# EAGLE design mikrofon-v1.2 (EAGLE 5.06)
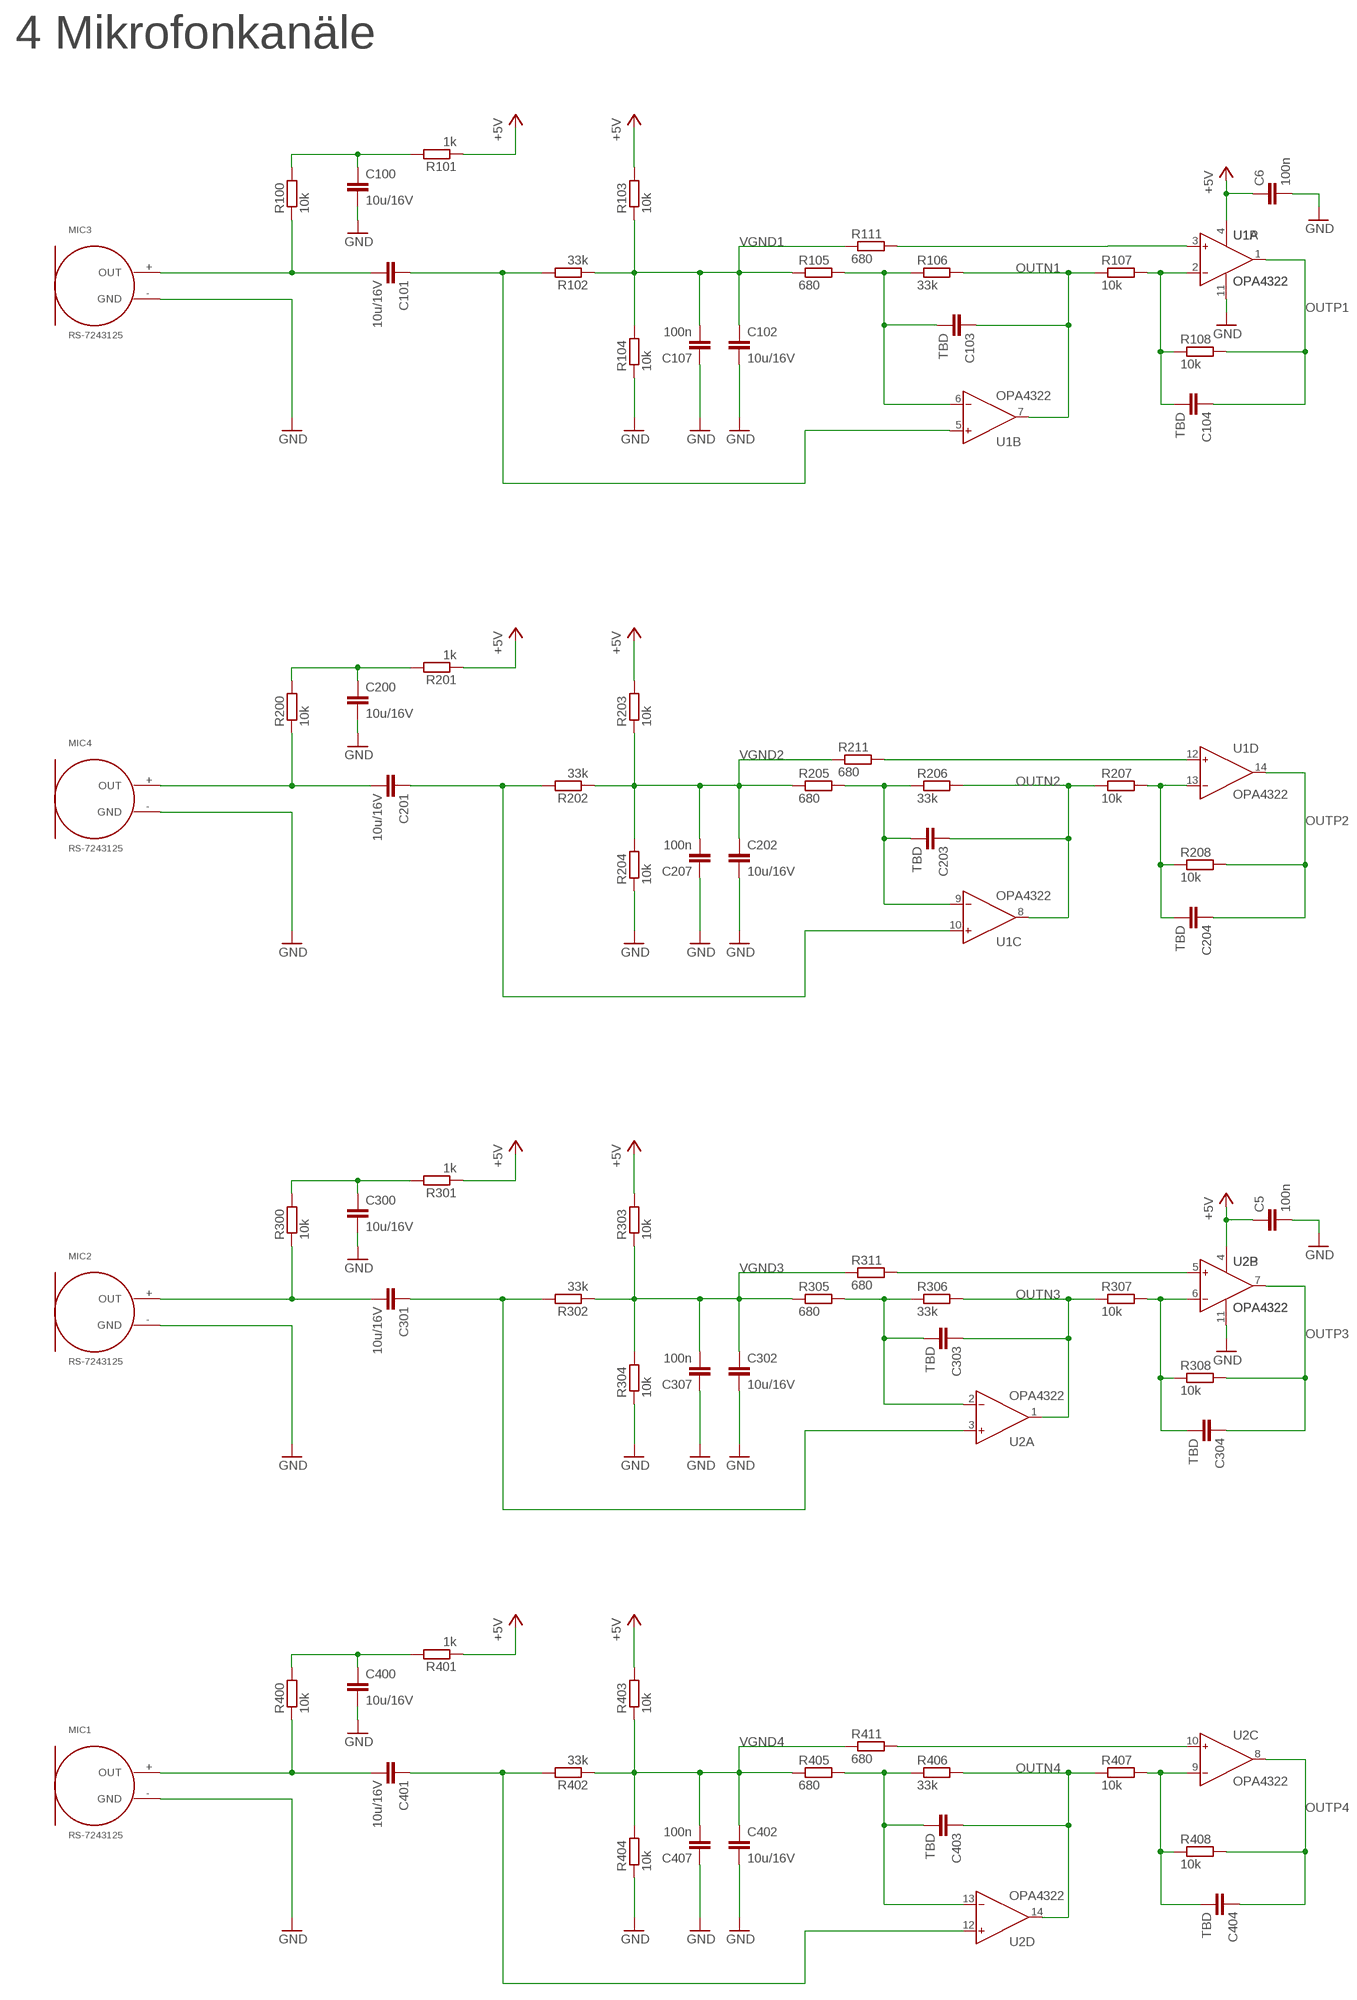
[diagram p0: schematic, sheet 1, part 1 of 2]
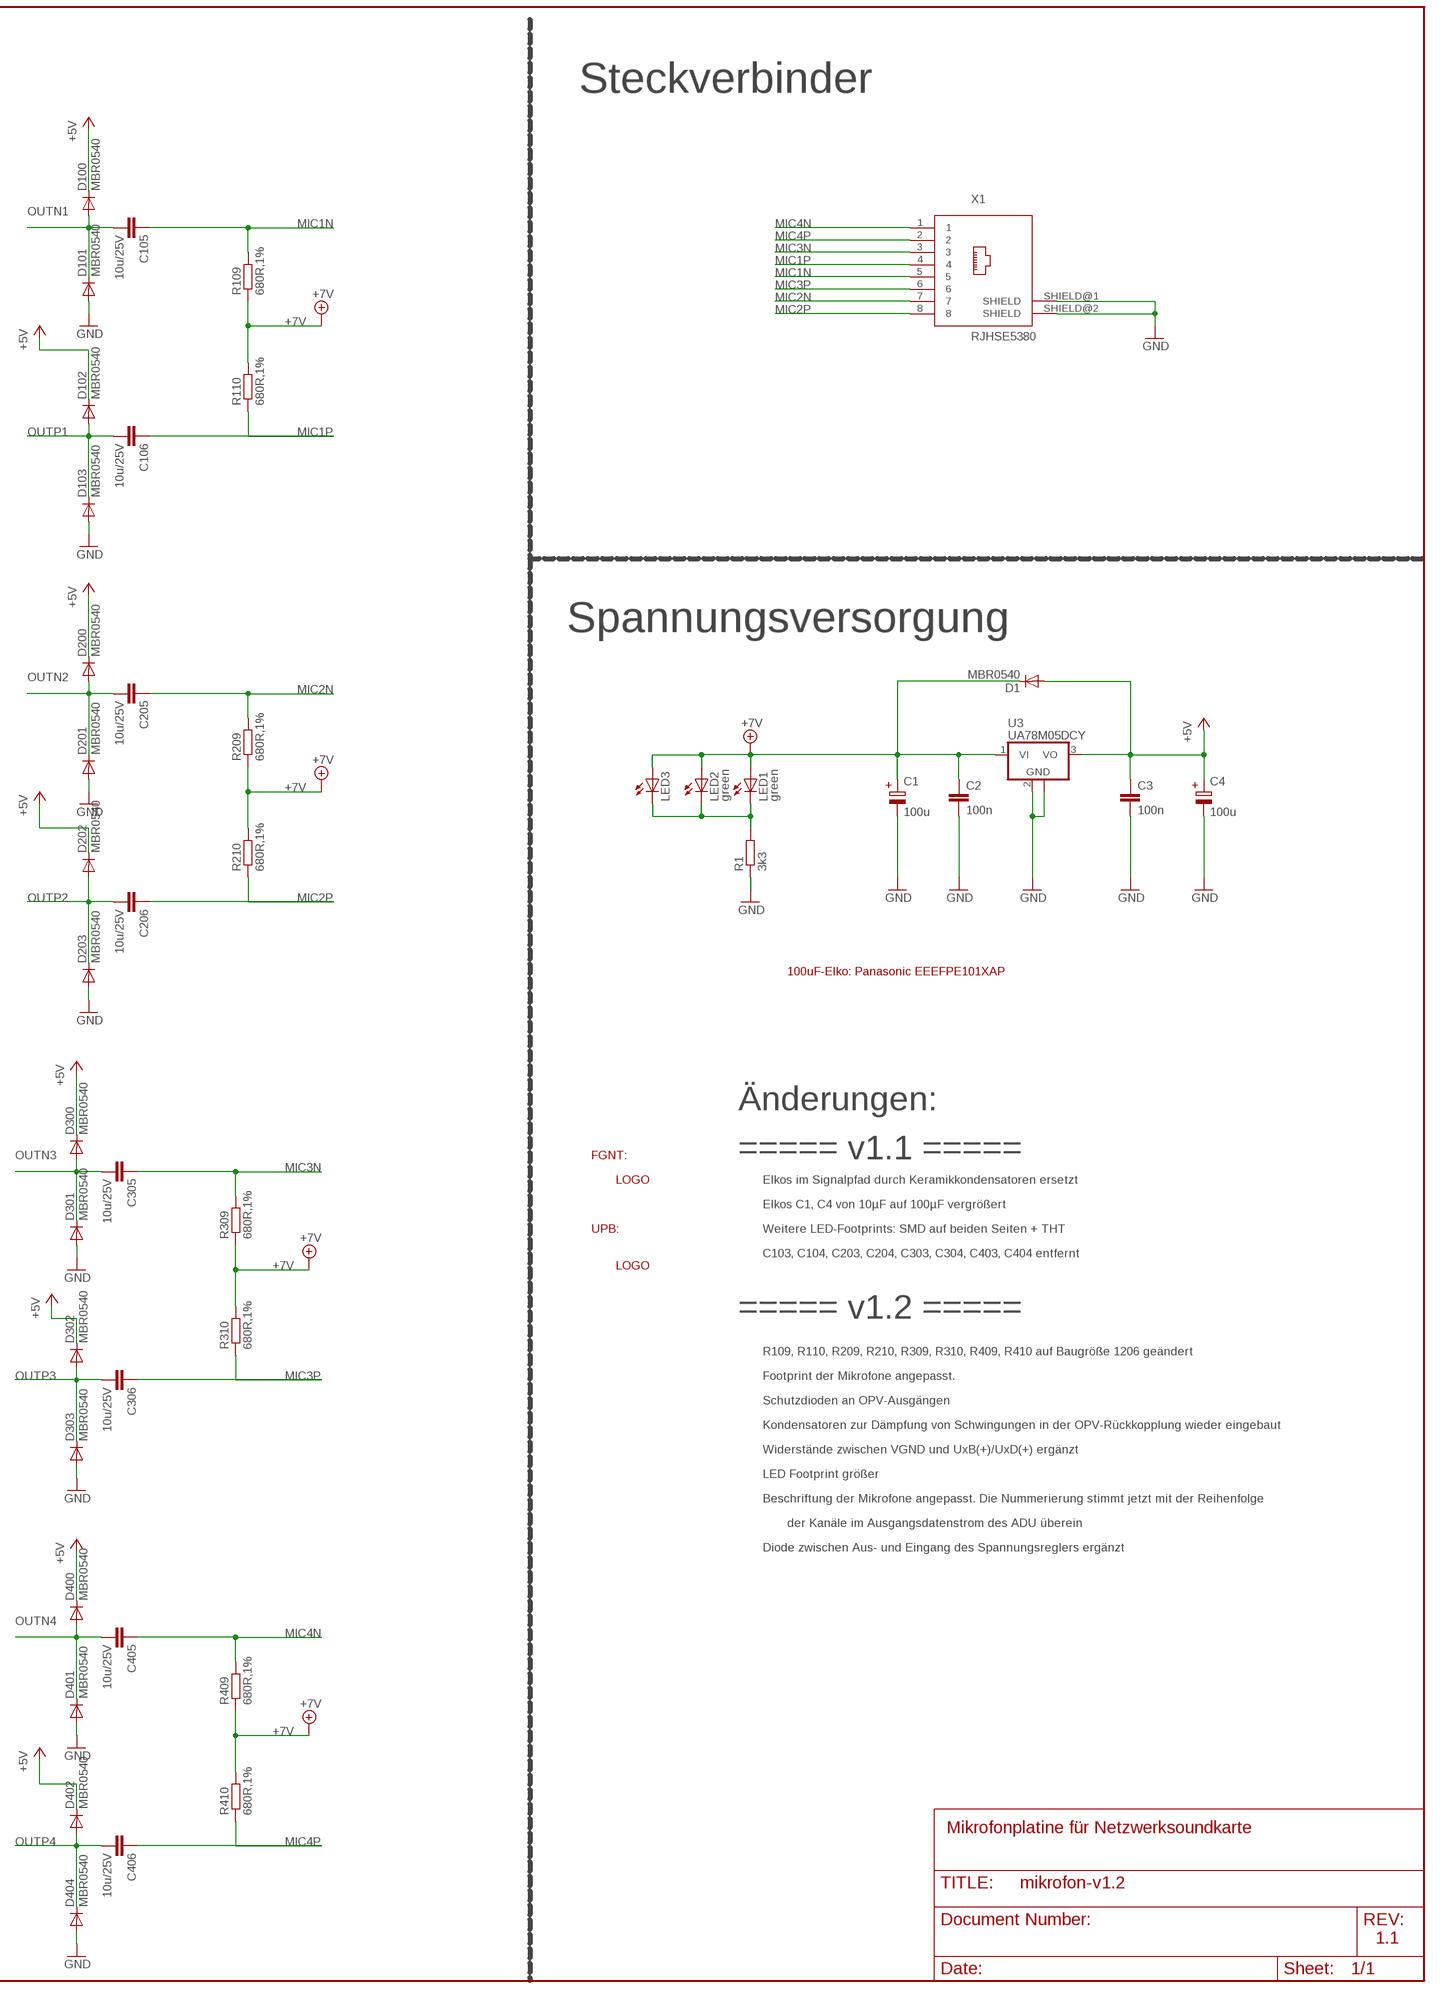
[diagram p1: schematic, sheet 1, part 2 of 2]

## Parts
C1  100u  PANASONIC_D8_LONGPAD  [PANASONIC_D8_LONGPAD]
C2  100n  C-EUC0603  [C0603]
C3  100n  C-EUC0603  [C0603]
C4  100u  PANASONIC_D8_LONGPAD  [PANASONIC_D8_LONGPAD]
C5  100n  C-EUC0603  [C0603]
C6  100n  C-EUC0603  [C0603]
C100  10u/16V  C-EUC1206  [C1206]
C101  10u/16V  C-EUC1206  [C1206]
C102  10u/16V  C-EUC1206  [C1206]
C103  TBD  C-EUC0603  [C0603]
C104  TBD  C-EUC0603  [C0603]
C105  10u/25V  C-EUC1206  [C1206]
C106  10u/25V  C-EUC1206  [C1206]
C107  100n  C-EUC0603  [C0603]
C200  10u/16V  C-EUC1206  [C1206]
C201  10u/16V  C-EUC1206  [C1206]
C202  10u/16V  C-EUC1206  [C1206]
C203  TBD  C-EUC0603  [C0603]
C204  TBD  C-EUC0603  [C0603]
C205  10u/25V  C-EUC1206  [C1206]
C206  10u/25V  C-EUC1206  [C1206]
C207  100n  C-EUC0603  [C0603]
C300  10u/16V  C-EUC1206  [C1206]
C301  10u/16V  C-EUC1206  [C1206]
C302  10u/16V  C-EUC1206  [C1206]
C303  TBD  C-EUC0603  [C0603]
C304  TBD  C-EUC0603  [C0603]
C305  10u/25V  C-EUC1206  [C1206]
C306  10u/25V  C-EUC1206  [C1206]
C307  100n  C-EUC0603  [C0603]
C400  10u/16V  C-EUC1206  [C1206]
C401  10u/16V  C-EUC1206  [C1206]
C402  10u/16V  C-EUC1206  [C1206]
C403  TBD  C-EUC0603  [C0603]
C404  TBD  C-EUC0603  [C0603]
C405  10u/25V  C-EUC1206  [C1206]
C406  10u/25V  C-EUC1206  [C1206]
C407  100n  C-EUC0603  [C0603]
D1  MBR0540  [SOD123]
D100  MBR0540  [SOD123]
D101  MBR0540  [SOD123]
D102  MBR0540  [SOD123]
D103  MBR0540  [SOD123]
D200  MBR0540  [SOD123]
D201  MBR0540  [SOD123]
D202  MBR0540  [SOD123]
D203  MBR0540  [SOD123]
D300  MBR0540  [SOD123]
D301  MBR0540  [SOD123]
D302  MBR0540  [SOD123]
D303  MBR0540  [SOD123]
D400  MBR0540  [SOD123]
D401  MBR0540  [SOD123]
D402  MBR0540  [SOD123]
D404  MBR0540  [SOD123]
LED1  green  LED0603_LONGPAD  [CHIPLED_0603_LONGPAD]
LED2  green  LED0603_LONGPAD  [CHIPLED_0603_LONGPAD]
LED3  LED3MM  [LED3MM]
MIC1  RS-7243125  [RS-7243125]
MIC2  RS-7243125  [RS-7243125]
MIC3  RS-7243125  [RS-7243125]
MIC4  RS-7243125  [RS-7243125]
R1  3k3  R-EU_R0603  [R0603]
R100  10k  R-EU_R0603  [R0603]
R101  1k  R-EU_R0603  [R0603]
R102  33k  R-EU_R0603  [R0603]
R103  10k  R-EU_R0603  [R0603]
R104  10k  R-EU_R0603  [R0603]
R105  680  R-EU_R0603  [R0603]
R106  33k  R-EU_R0603  [R0603]
R107  10k  R-EU_R0603  [R0603]
R108  10k  R-EU_R0603  [R0603]
R109  680R,1%  R-EU_R1206  [R1206]
R110  680R,1%  R-EU_R1206  [R1206]
R111  680  R-EU_R0603  [R0603]
R200  10k  R-EU_R0603  [R0603]
R201  1k  R-EU_R0603  [R0603]
R202  33k  R-EU_R0603  [R0603]
R203  10k  R-EU_R0603  [R0603]
R204  10k  R-EU_R0603  [R0603]
R205  680  R-EU_R0603  [R0603]
R206  33k  R-EU_R0603  [R0603]
R207  10k  R-EU_R0603  [R0603]
R208  10k  R-EU_R0603  [R0603]
R209  680R,1%  R-EU_R1206  [R1206]
R210  680R,1%  R-EU_R1206  [R1206]
R211  680  R-EU_R0603  [R0603]
R300  10k  R-EU_R0603  [R0603]
R301  1k  R-EU_R0603  [R0603]
R302  33k  R-EU_R0603  [R0603]
R303  10k  R-EU_R0603  [R0603]
R304  10k  R-EU_R0603  [R0603]
R305  680  R-EU_R0603  [R0603]
R306  33k  R-EU_R0603  [R0603]
R307  10k  R-EU_R0603  [R0603]
R308  10k  R-EU_R0603  [R0603]
R309  680R,1%  R-EU_R1206  [R1206]
R310  680R,1%  R-EU_R1206  [R1206]
R311  680  R-EU_R0603  [R0603]
R400  10k  R-EU_R0603  [R0603]
R401  1k  R-EU_R0603  [R0603]
R402  33k  R-EU_R0603  [R0603]
R403  10k  R-EU_R0603  [R0603]
R404  10k  R-EU_R0603  [R0603]
R405  680  R-EU_R0603  [R0603]
R406  33k  R-EU_R0603  [R0603]
R407  10k  R-EU_R0603  [R0603]
R408  10k  R-EU_R0603  [R0603]
R409  680R,1%  R-EU_R1206  [R1206]
R410  680R,1%  R-EU_R1206  [R1206]
R411  680  R-EU_R0603  [R0603]
U1  OPA4322  [TSSOP14]
U2  OPA4322  [TSSOP14]
U3  UA78M05DCY  [SOT223]
U$1  FGNT_NEG  [NT_T_NEG]
U$2  UPB_NEG  [UPB_T_NEG]
X1  RJHSE5380  [RJHSE5380]

## Nets
+5V: C3.1 C4.+ C5.1 C6.1 D1.A D100.C D102.C D200.C D202.C D300.C D302.C D400.C D402.C R101.1 R103.2 R201.1 R203.2 R301.1 R303.2 R401.1 R403.2 U1.4(P:V+) U2.4(P:V+) U3.3(VO)
+7V: C1.+ C2.1 D1.C LED1.A LED2.A LED3.A R109.1 R110.2 R209.1 R210.2 R309.1 R310.2 R409.1 R410.2 U3.1(VI)
GND: C1.- C2.2 C3.2 C4.- C5.2 C6.2 C100.2 C102.2 C107.1 C200.2 C202.2 C207.1 C300.2 C302.2 C307.1 C400.2 C402.2 C407.1 D101.A D103.A D201.A D203.A D301.A D303.A D401.A D404.A MIC1.-(GND) MIC2.-(GND) MIC3.-(GND) MIC4.-(GND) R1.1 R104.1 R204.1 R304.1 R404.1 U1.11(P:V-) U2.11(P:V-) U3.2(GND) U3.4(GND) X1.SHIELD@1(SHIELD) X1.SHIELD@2(SHIELD)
MIC1N: C105.1 R109.2 X1.5
MIC1P: C106.1 R110.1 X1.4
MIC2N: C205.1 R209.2 X1.7
MIC2P: C206.1 R210.1 X1.8
MIC3N: C305.1 R309.2 X1.3
MIC3P: C306.1 R310.1 X1.6
MIC4N: C405.1 R409.2 X1.1
MIC4P: C406.1 R410.1 X1.2
N$1: C103.2 R105.2 R106.1 U1.6(B:IN-)
N$2: C303.2 R305.2 R306.1 U2.2(A:IN-)
N$3: LED1.C LED2.C LED3.K(C) R1.2
N$4: R211.2 U1.12(D:IN+)
N$5: R111.2 U1.3(A:IN+)
N$6: C401.2 MIC1.+(OUT) R400.1
N$7: C101.2 MIC3.+(OUT) R100.1
N$8: C401.1 R402.2 U2.12(D:IN+)
N$9: C101.1 R102.2 U1.5(B:IN+)
N$10: C100.1 R100.2 R101.2
N$11: C400.1 R400.2 R401.2
N$12: C104.2 R107.2 R108.1 U1.2(A:IN-)
N$13: C404.2 R407.2 R408.1 U2.9(C:IN-)
N$14: C203.2 R205.2 R206.1 U1.9(C:IN-)
N$15: R411.2 U2.10(C:IN+)
N$16: R311.2 U2.5(B:IN+)
N$18: C301.2 MIC2.+(OUT) R300.1
N$19: C301.1 R302.2 U2.3(A:IN+)
N$20: C300.1 R300.2 R301.2
N$21: C304.2 R307.2 R308.1 U2.6(B:IN-)
N$22: C201.2 MIC4.+(OUT) R200.1
N$23: C201.1 R202.2 U1.10(C:IN+)
N$24: C200.1 R200.2 R201.2
N$25: C204.2 R207.2 R208.1 U1.13(D:IN-)
OUTN1: C103.1 C105.2 D100.A D101.C R106.2 R107.1 U1.7(B:OUT)
OUTN2: C203.1 C205.2 D200.A D201.C R206.2 R207.1 U1.8(C:OUT)
OUTN3: C303.1 C305.2 D300.A D301.C R306.2 R307.1 U2.1(A:OUT)
OUTN4: C403.1 C405.2 D400.A D401.C R406.2 R407.1 U2.14(D:OUT)
OUTP1: C104.1 C106.2 D102.A D103.C R108.2 U1.1(A:OUT)
OUTP2: C204.1 C206.2 D202.A D203.C R208.2 U1.14(D:OUT)
OUTP3: C304.1 C306.2 D302.A D303.C R308.2 U2.7(B:OUT)
OUTP4: C404.1 C406.2 D402.A D404.C R408.2 U2.8(C:OUT)
R405: C403.2 R405.2 R406.1 U2.13(D:IN-)
VGND1: C102.1 C107.2 R102.1 R103.1 R104.2 R105.1 R111.1
VGND2: C202.1 C207.2 R202.1 R203.1 R204.2 R205.1 R211.1
VGND3: C302.1 C307.2 R302.1 R303.1 R304.2 R305.1 R311.1
VGND4: C402.1 C407.2 R402.1 R403.1 R404.2 R405.1 R411.1

## Notes on the sheet
- 4 Mikrofonkanäle | Steckverbinder
- Spannungsversorgung
- 100uF-Elko: Panasonic EEEFPE101XAP
- Änderungen:
- FGNT: | ===== v1.1 =====
- Elkos im Signalpfad durch Keramikkondensatoren ersetzt
- Elkos C1, C4 von 10µF auf 100µF vergrößert
- UPB: | Weitere LED-Footprints: SMD auf beiden Seiten + THT
- C103, C104, C203, C204, C303, C304, C403, C404 entfernt
- ===== v1.2 =====
- R109, R110, R209, R210, R309, R310, R409, R410 auf Baugröße 1206 geändert
- Footprint der Mikrofone angepasst.
- Schutzdioden an OPV-Ausgängen
- Kondensatoren zur Dämpfung von Schwingungen in der OPV-Rückkopplung wieder eingebaut
- Widerstände zwischen VGND und UxB(+)/UxD(+) ergänzt
- LED Footprint größer
- Beschriftung der Mikrofone angepasst. Die Nummerierung stimmt jetzt mit der Reihenfolge
- der Kanäle im Ausgangsdatenstrom des ADU überein
- Diode zwischen Aus- und Eingang des Spannungsreglers ergänzt
- Mikrofonplatine für Netzwerksoundkarte
- 1.1

## Library data of the parts
C1 C4 = discrete:PANASONIC_D8_LONGPAD
C2 C3 C5 C6 C100-C107 C200-C207 C300-C307 C400-C407 = rcl:C-EU: CAPACITOR, European symbol
D1 D100-D103 D200-D203 D300-D303 D400-D402 D404 = diodes:MBR0540: SCHOTTKY BARRIER RECTIFIER 0.5A 40V
LED1 LED2 = diodes:LED0603_LONGPAD: 0603 Standard Chip LED Package hat verlängerte Pads
LED3 = led:LED: LED OSRAM: - CHIPLED LG R971, LG N971, LY N971, LG Q971, LY Q971, LO R971, LY R971 LH N974, LH R974 LS Q976, LO Q976, LY Q976 LO Q996 - Hyper CHIPLED LW Q18S LB Q993, LB Q99A, LB R99A - SideLED LS A670, LO A670, LY A670, LG A670, LP A670 LB A673, LV A673, LT A673, LW A673 LH A674 LY A675 LS A676, LA A676, LO A676, LY A676, LW A676 LS A679, LY A679, LG A679 - Hyper Micro SIDELED® LS Y876, LA Y876, LO Y876, LY Y876 LT Y87S - SmartLED LW L88C, LW L88S LB L89C, LB L89S, LG L890 LS L89K, LO L89K, LY L89K LS L896, LA L896, LO L896, LY L896 - TOPLED LS T670, LO T670, LY T670, LG T670, LP T670 LSG T670, LSP T670, LSY T670, LOP T670, LYG T670 LG T671, LOG T671, LSG T671 LB T673, LV T673, LT T673, LW T673 LH T674 LS T676, LA T676, LO T676, LY T676, LB T676, LH T676, LSB T676, LW T676 LB T67C, LV T67C, LT T67C, LS T67K, LO T67K, LY T67K, LW E67C LS E67B, LA E67B, LO E67B, LY E67B, LB E67C, LV E67C, LT E67C LW T67C LS T679, LY T679, LG T679 LS T770, LO T770, LY T770, LG T770, LP T770 LB T773, LV T773, LT T773, LW T773 LH T774 LS E675, LA E675, LY E675, LS T675 LS T776, LA T776, LO T776, LY T776, LB T776 LHGB T686 LT T68C, LB T68C - Hyper Mini TOPLED® LB M676 - Mini TOPLED Santana® LG M470 LS M47K, LO M47K, LY M47K Source: http://www.osram.convergy.de LUXEON: - LUMILED® LXK2-PW12-R00, LXK2-PW12-S00, LXK2-PW14-U00, LXK2-PW14-V00 LXK2-PM12-R00, LXK2-PM12-S00, LXK2-PM14-U00 LXK2-PE12-Q00, LXK2-PE12-R00, LXK2-PE12-S00, LXK2-PE14-T00, LXK2-PE14-U00 LXK2-PB12-K00, LXK2-PB12-L00, LXK2-PB12-M00, LXK2-PB14-N00, LXK2-PB14-P00, LXK2-PB14-Q00 LXK2-PR12-L00, LXK2-PR12-M00, LXK2-PR14-Q00, LXK2-PR14-R00 LXK2-PD12-Q00, LXK2-PD12-R00, LXK2-PD12-S00 LXK2-PH12-R00, LXK2-PH12-S00 LXK2-PL12-P00, LXK2-PL12-Q00, LXK2-PL12-R00 Source: www.luxeon.com KINGBRIGHT: KA-3528ASYC Source: www.kingbright.com
MIC1-MIC4 = analog:RS-7243125: Electret Condenser Microphone SNR > 60dB Sensitivity -40dB Standard operating voltage: 2V Max operating voltage: 10V Max current consumption: 0.5mA
R1 R100-R111 R200-R211 R300-R311 R400-R411 = rcl:R-EU_: RESISTOR, European symbol
U1 U2 = analog:OPA4322: 20-MHz, Low-Noise, 1.8-V, RRI/O, CMOS Operational Amplifier
U3 = linear:UA78M*: POSITIVE-VOLTAGE REGULATORS Source: http://focus.ti.com/lit/ds/symlink/ua78m33.pdf
U$1 = logo:FGNT_NEG
U$2 = logo:UPB_NEG: UPB-Logo (Negativschrift in Kupfer)
X1 = connector:RJHSE5380

## Board
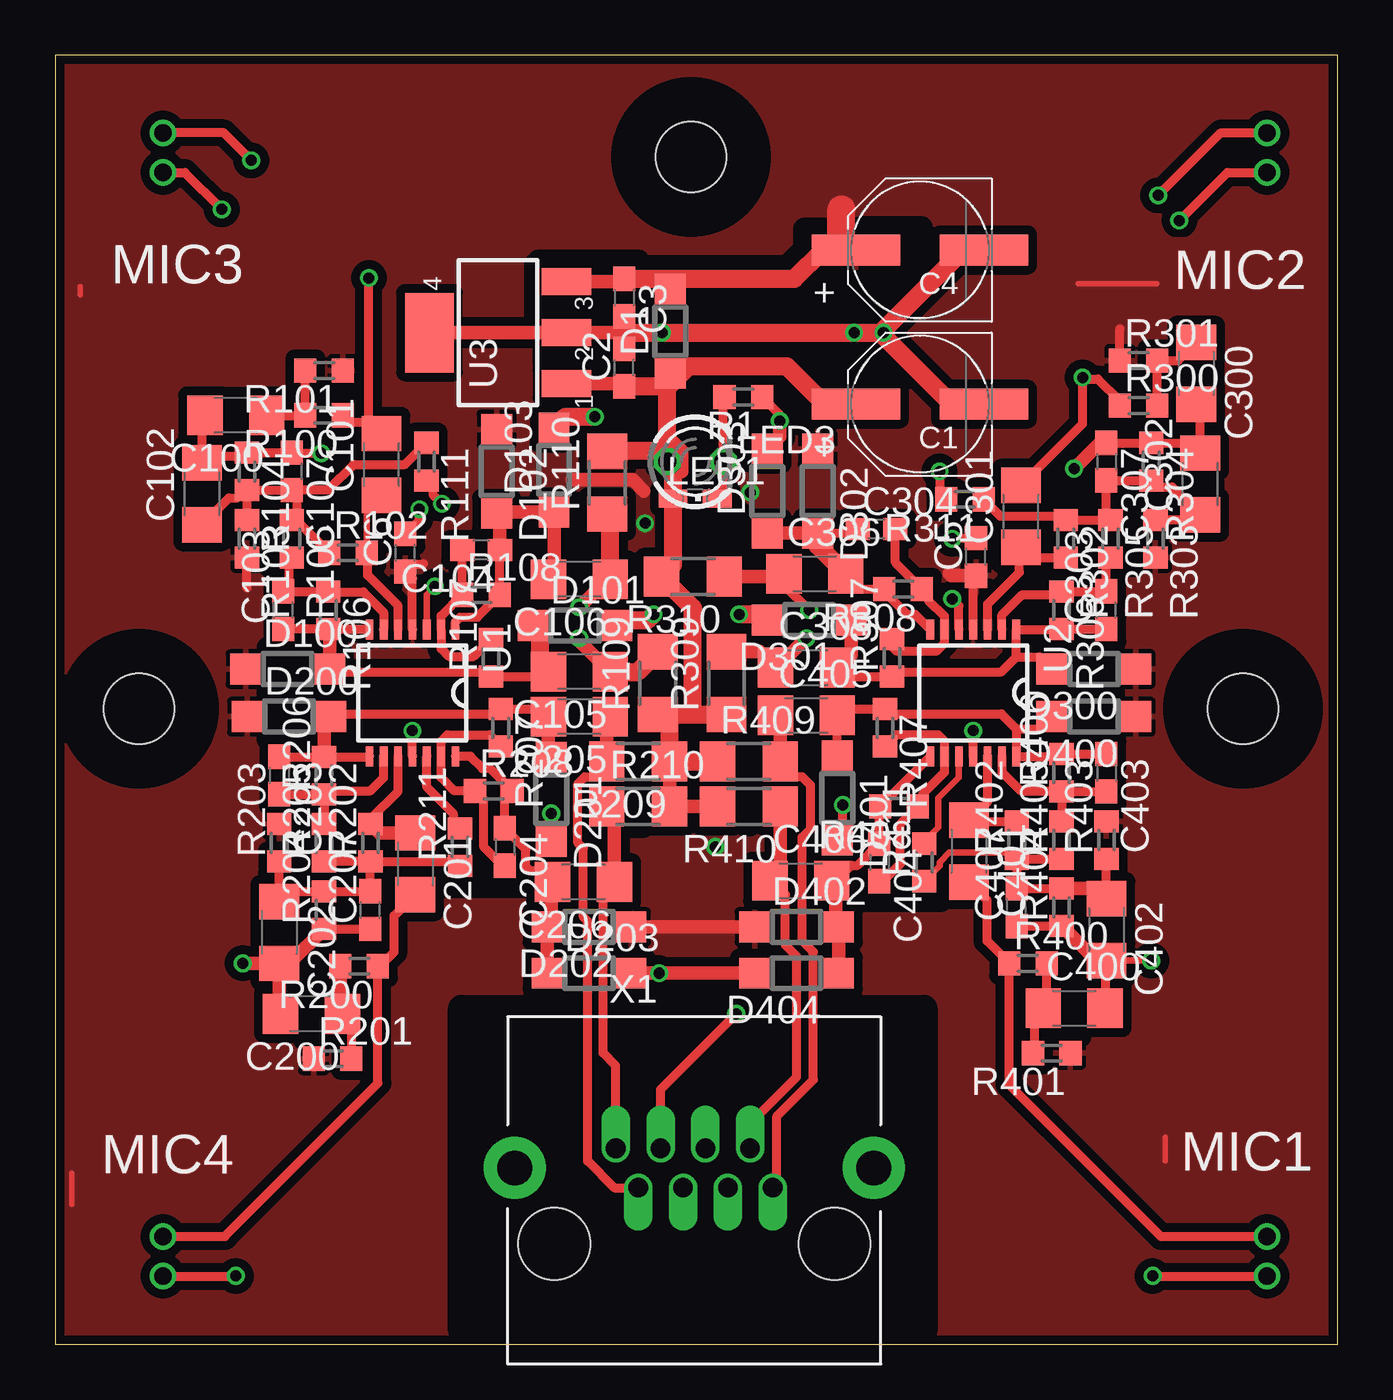
[diagram p2: board, top side]
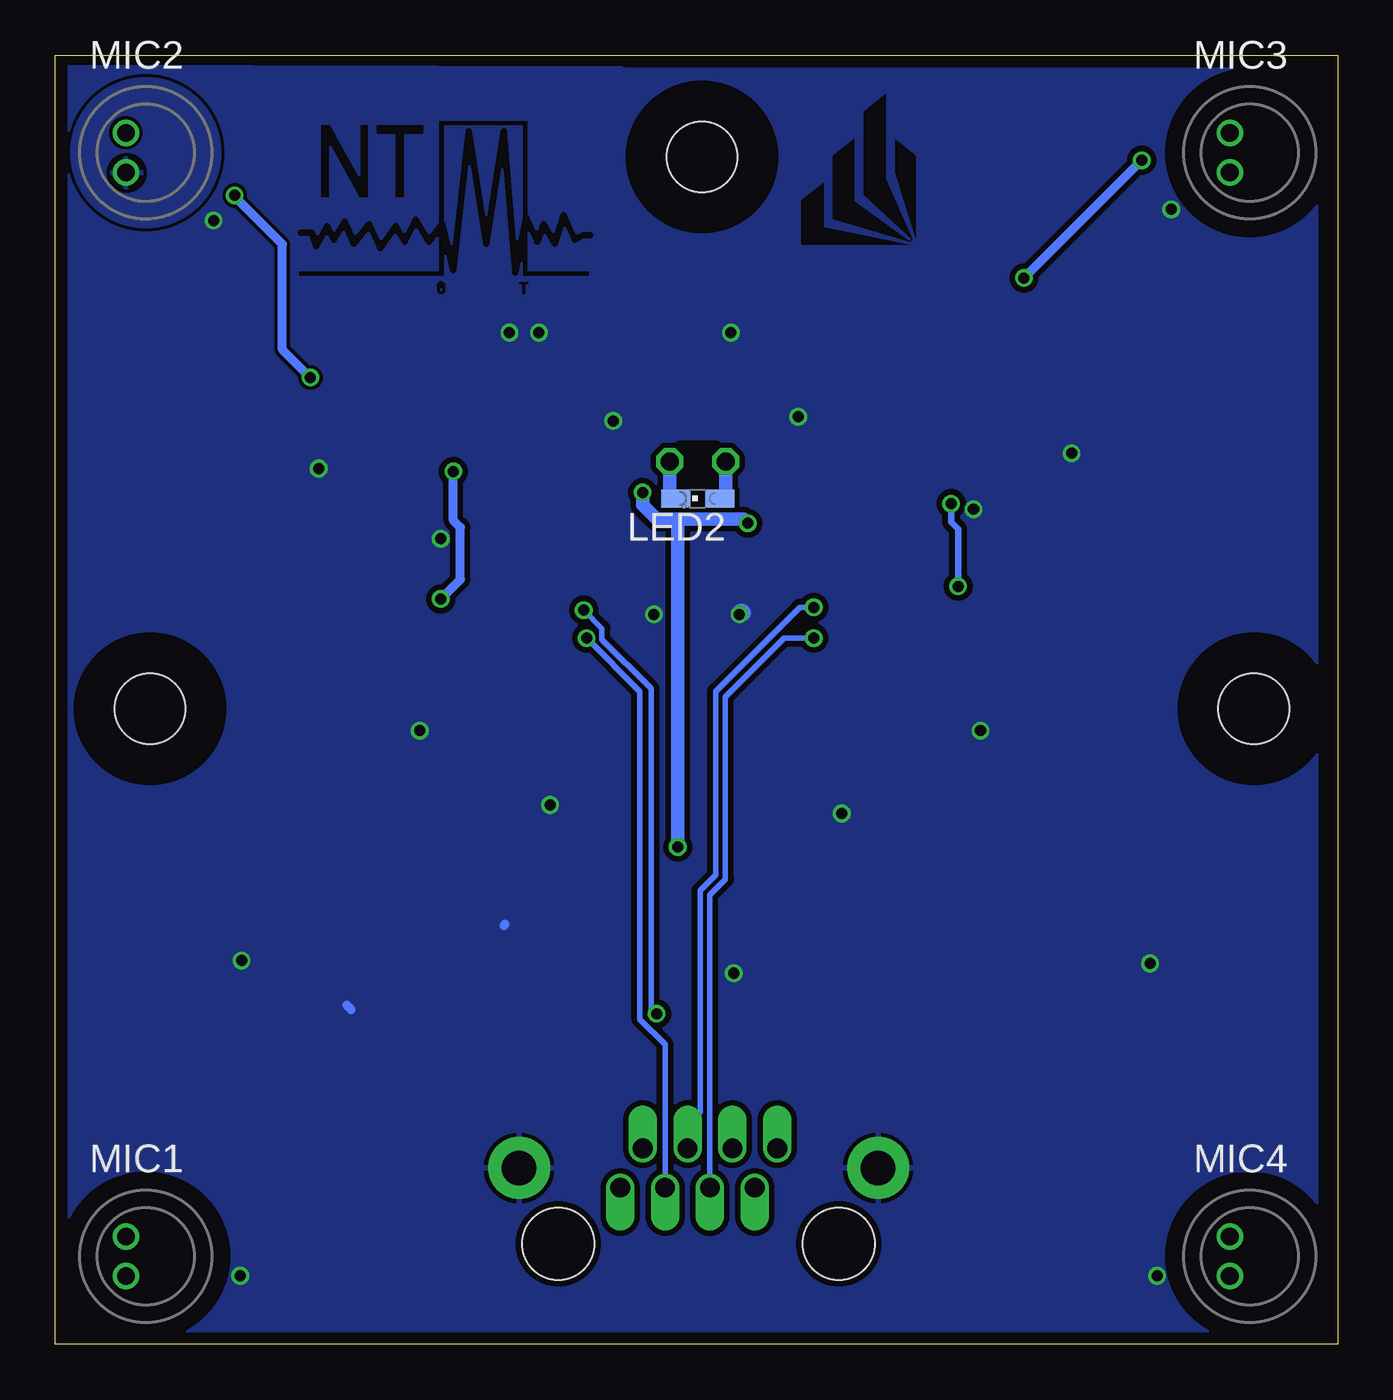
[diagram p3: board, bottom side, seen from below]

Size 58.09 x 58.41 mm. Coordinates in mm from the lower left corner, seen from the top.
Outline: 58.09,58.41 0,58.41 0,0 58.09,0 58.09,58.41
Copper layers (1*16): Top 0.035mm / dielectric 1.5mm / Bottom 0.035mm
Design rules "PCB-POOL Standard *": minimum track width 0.15mm, minimum drill 0.3mm, track to track 0.15mm, track to pad 0.15mm, pad to pad 0.15mm, via to via 0.15mm, smd to smd 0.15mm, copper to edge 0.3mm, drill to drill 0.2mm, minimum pad ring 0.2mm, minimum via ring 0.15mm, stop-mask expansion 0.075mm, vias tented up to drill 0mil, thermal gap 0.2mm
Holes 3.2 mm at 3.8,28.8 28.8,53.8 53.8,28.8
tRestrict: area 0.8,25.8 to 6.8,31.8; area 25.8,50.8 to 31.8,56.8; area 50.8,25.8 to 56.8,31.8; 52 lines
bRestrict: area 4,2.2 to 5.7,3.9; area 54.1,2.2 to 55.7,3.9; area 54,52.2 to 55.7,53.9; area 4,52.2 to 5.7,53.9; area 0.8,25.8 to 6.8,31.8; area 25.8,50.8 to 31.8,56.8; area 50.8,25.8 to 56.8,31.8; 1 lines

### Footprints (pad centres in the part's own frame; a part is rotated, then mirrored left to right if it is on the bottom)
PANASONIC_D8_LONGPAD = smd 4 x 1.4: + 2.9,0; - -2.9,0
C0603 = smd 1.1 x 1: 1 -0.85,0; 2 0.85,0
C1206 = smd 1.6 x 1.8: 1 -1.4,0; 2 1.4,0
SOD123 = smd 1.4 x 1.4: A 1.9,0; C -1.9,0
CHIPLED_0603_LONGPAD = smd 0.8 x 1.3: A 0,-1; C 0,1
LED3MM = drill 0.813 octagon: A -1.27,0; K 1.27,0
RS-7243125 = drill 0.8 round: + -0.9,0.9; - -0.9,-0.9
R0603 = smd 1 x 1.1: 1 -0.85,0; 2 0.85,0
R1206 = smd 1.6 x 1.803: 1 -1.422,0; 2 1.422,0
TSSOP14 = smd 0.9 x 0.35: 1 -2.875,1.95; 2 -2.875,1.3; 3 -2.875,0.65; 4 -2.875,0; 5 -2.875,-0.65; 6 -2.875,-1.3; 7 -2.875,-1.95; 8 2.875,-1.95; 9 2.875,-1.3; 10 2.875,-0.65; 11 2.875,0; 12 2.875,0.65; 13 2.875,1.3; 14 2.875,1.95
SOT223 = smd 1.219 x 2.235: 1 -2.311,-3.099; 2 0,-3.099; 3 2.311,-3.099 | smd 3.6 x 2.2: 4 0,3.099
RJHSE5380 = drill 0.89 pad 1.25 offset: 1 7.11,-1.78; 2 6.09,0; 3 5.08,-1.78; 4 4.06,0; 5 3.05,-1.78; 6 2.03,0; 7 1.02,-1.78; 8 0,0 | drill 1.57 pad 2.8 round: SHIELD@1 -4.57,-0.89; SHIELD@2 11.69,-0.89 | hole 3.25: -2.79,-4.32; 9.91,-4.32

### Placement (x,y rotation side)
C1  39.17,42.6 180 top
C2  25.77,44.25 90 top
C3  25.77,47.42 270 top
C4  39.17,49.58 180 top
C5  41.71,35.68 90 top
C6  15.86,35.87 90 top
C100  8.18,42.09 180 top
C101  14.78,39.87 90 top
C102  6.66,38.53 90 top
C103  10.34,33.26 90 top
C104  19.29,35.99 180 top
C105  23.74,30.47 180 top
C106  23.74,34.66 180 top
C107  10.72,39.55 270 top
C200  11.61,14.98 180 top
C201  16.31,21.77 270 top
C202  10.15,18.66 270 top
C203  10.15,25.77 270 top
C204  20.37,22.53 270 top
C205  23.74,28.44 180 top
C206  23.93,20.94 180 top
C207  14.28,19.67 90 top
C300  51.68,44 270 top
C301  43.74,37.52 90 top
C302  51.87,38.98 90 top
C303  47.61,33.26 90 top
C304  37.2,36.95 0 top
C305  34.02,30.66 0 top
C306  34.4,34.91 0 top
C307  47.61,40 270 top
C400  46.15,15.23 0 top
C401  41.39,22.34 270 top
C402  47.61,18.79 270 top
C403  47.61,25.9 270 top
C404  37.33,21.83 270 top
C405  34.02,28.5 0 top
C406  33.77,21.01 0 top
C407  43.55,19.8 90 top
D1  27.86,45.9 90 top
D100  10.53,30.6 0 top
D101  23.55,32.57 0 top
D102  19.99,39.55 270 top
D103  22.59,39.61 90 top
D200  10.59,28.44 0 top
D201  22.47,24.69 270 top
D202  24.18,18.91 180 top
D203  24.18,16.82 0 top
D300  47.04,30.6 180 top
D301  34.15,32.82 180 top
D302  34.53,38.66 270 top
D303  32.25,38.66 90 top
D400  47.04,28.44 180 top
D401  35.42,24.75 270 top
D402  33.58,18.91 0 top
D404  33.58,16.82 180 top
LED1  28.99,38.32 270 top
LED2  28.99,38.32 90 bottom
LED3  28.99,39.99 0 top
MIC1  53.99,3.99 0 bottom
MIC2  53.99,53.99 0 bottom
MIC3  3.99,53.99 0 bottom
MIC4  3.99,3.99 0 bottom
R1  31.17,42.92 180 top
R100  12.18,42.09 180 top
R101  12.18,44.12 180 top
R102  13.26,35.87 0 top
R103  8.69,36.5 270 top
R104  8.69,39.55 270 top
R105  10.72,36.5 270 top
R106  12.37,33.26 270 top
R107  19.74,31.1 90 top
R108  19.29,33.96 0 top
R109  27.29,29.96 90 top
R110  25.01,39.04 90 top
R111  16.82,40 270 top
R200  13.77,17.13 180 top
R201  12.56,12.94 0 top
R202  14.28,22.72 90 top
R203  10.15,22.72 90 top
R204  12.18,19.67 90 top
R205  12.18,22.72 90 top
R206  12.18,25.77 90 top
R207  20.18,27.93 270 top
R208  19.86,25.07 0 top
R209  26.4,26.41 180 top
R210  26.4,24.37 0 top
R211  18.34,22.53 90 top
R300  49.07,42.54 0 top
R301  49.07,44.57 0 top
R302  45.77,36.5 270 top
R303  49.83,36.5 270 top
R304  49.64,40 270 top
R305  47.8,36.5 270 top
R306  45.58,33.26 270 top
R307  37.9,31.1 90 top
R308  38.4,34.22 180 top
R309  30.4,29.96 90 top
R310  28.88,34.79 180 top
R311  41.2,38.28 180 top
R400  44.06,17.26 0 top
R401  45.14,13.2 180 top
R402  43.55,22.85 90 top
R403  47.61,22.85 90 top
R404  45.58,19.8 90 top
R405  45.58,22.85 90 top
R406  45.58,25.9 90 top
R407  37.58,27.93 270 top
R408  38.21,24.37 180 top
R409  31.42,26.41 0 top
R410  31.42,24.37 180 top
R411  39.36,21.83 90 top
U1  16.18,29.52 270 top
U2  41.58,29.52 270 top
U3  20.05,45.84 90 top
U$1  40.56,51.36 0 bottom
U$2  18.72,51.23 0 bottom
X1  25.39,8.88 0 top

### Tracks (layer width: path | path; a pad name or v marks a point on that pad's centre or on a via)
+5V  (via drill 0.5)
  Top 0.254: 48.22,46 48.25,46.03 | 46.34,48.06 49.9,48.06 | 0.75,6.34 0.75,7.74 | 50.28,8.31 50.28,9.39 | 1.13,47.55 1.13,47.93
  Top 0.406: 8.69,34.28 R103.2 | R301.1 48.22,46 | 16.05,35.36 16.69,35.36 | U2.4 41.58,34.76 | D1.A 27.86,48.15 27.74,48.27 | U1.4 16.18,34.7 C6.1
  Top 0.61: U3.3 25.77,48.15 C3.1 | C5.1 40.59,34.83 40.5,34.91 | D202.C D402.C | 23.42,39.17 26.15,39.17 26.66,38.66
  Top 0.813: C4.+ 35.61,49.58 34.79,49.58 33.48,48.27 27.74,48.27 C3.1
  Top 1.27: 35.61,49.58 35.61,51.43
  Bottom 0.61: v29.9,22.53 29.9,37.39 | 29.9,37.39 30.85,37.39 31.48,38.03 v31.48,38.6 | 29.9,37.39 26.91,37.39 v26.72,37.2
  pour Top (isolate 0.406): 57.99,57.99 -0.01,57.99 -0.01,-0.01 57.99,-0.01
  pour Top: 50.41,10.53 56.88,10.53 56.88,7.36 50.41,7.36
  pour Top: 48.69,50.09 56.88,50.09 56.88,47.17 48.69,47.17
  pour Top: 0.56,10.09 8.75,10.09 8.75,7.17 0.56,7.17
  pour Top: 49.07,10.34 57.26,10.34 57.26,7.42 49.07,7.42
  pour Top: 0.94,50.28 9.13,50.28 9.13,47.36 0.94,47.36
+7V
  Top 0.406: C2.1 25.55,43.61 | D1.C 27.86,43.53
  Top 0.61: U3.1 25.77,43.53 C2.1 | 27.83,25.9 R210.2 R410.2 | 28.37,39.55 28.37,40.5 27.99,40.88 27.72,40.88
  Top 0.813: 25.67,43.3 C2.1 27.67,43.4 | 27.72,40.5 27.72,40.88 27.72,43.34 27.78,43.4 | LED3.A 27.72,40.5 | C1.+ 34.85,42.6 33.13,44.31 28.69,44.31 27.78,43.4 | R310.2 27.29,34.62 | LED3.A 27.98,39.72 | R109.1 R309.1 | R109.1 27.83,28.54 R209.1 | 27.83,25.9 R209.1 | R109.1 28.88,28.54 28.88,33.37 R310.2 | LED3.A 27.99,39.72 LED2.A 27.99,35.32 R310.2 | 27.67,43.4 | 27.78,43.4 27.67,43.4 | 27.78,43.4 27.78,43.91 D1.C | R110.2 27.72,40.46 27.72,40.5 | R209.1 R409.1
  Bottom 0.61: LED2.A 27.72,38.32 LED3.A
GND  (via drill 0.5)
  Top 0.254: 8.54,40.25 R104.1 | 7.1,40.25 6.79,39.93 C102.2
  Top 0.305: 6.66,41.97 C100.2 | C402.2 47.15,16.92 | C402.2 v49.64,17.39 | C402.2 47.55,17.32 | 47.57,40.88 C307.1 | C6.2 15.86,36.5 15.86,36.57 | 46.98,17.77 47.23,17.77 C402.2 | C107.1 10.74,40.38
  Top 0.406: 25.77,46.47 C3.2 | U2.11 v41.58,27.8 | R104.1 C107.1 | R204.1 C207.1 | C407.1 R404.1 | C307.1 R304.1 51.07,40.84 51.17,40.95 51.17,40.84 51.63,40.38 C302.2 51.87,42.41 C300.2 | C102.2 6.66,41.97 | 47.55,17.32 C400.2 | U1.11 v16.18,27.8 | 7.1,40.25 8.54,40.25 | 10.74,40.38 v12.05,40.38 | MIC4.- v8.17,3.09 v8.18,3.1 | MIC3.- 5.88,53.09 v7.54,51.43 | v50.91,50.92 53.09,53.09 MIC2.- | v49.71,3.1 49.72,3.09 MIC1.- | 15.86,36.5 15.86,36.69 16.5,37.33 v16.5,37.84 | v35.67,24.44 35.67,23.11 D401.A | v32.82,41.84 32.82,42.12 R1.1 | D303.A | v40.63,36.5 41.68,36.5 C5.2 | 10.68,17.32 10.21,17.32 C202.2
  Top 0.61: U3.4 U3.2 25.77,45.84 | 25.77,46.47 25.77,46.79 | 47.57,40.88 47.36,40.88 v46.15,39.68 | D201.A v22.47,24.06 | 46.98,17.77 46.76,17.77 R404.1 | D203.A v27.36,16.82 D404.A | 10.68,17.32 R204.1 | C200.2 10.15,15.04 C202.2 v8.5,17.26 | v32.82,41.84 32.82,41.13 D303.A
  Top 0.813: C4.- 41.14,49.58 37.39,45.84 37.38,45.84 | 25.77,45.84 v27.48,45.84 v36.18,45.84 37.38,45.84 | 37.38,45.84 v37.52,45.84 | C1.- 40.62,42.6 37.38,45.84 | v24.44,42.03 23.11,42.03 D103.A | v27.1,33.07 26.85,32.82 25.7,32.82 D101.A | v30.98,33.07 32,33.07 D301.A
  Top 1.016: C2.2 25.77,45.84 25.77,46.47
  Bottom 0.305: v12.05,40.38 11.99,40.38
  Bottom 0.406: 44.69,15.17 44.88,15.36 | 37.71,19.04 37.77,18.98
  Bottom 0.813: v27.1,33.07 27.04,33.14 26.98,33.14
  pour Bottom (isolate 0.254): 57.45,57.77 48.18,57.77 32.44,57.77 0.94,57.77 0.94,0.62 57.45,0.62
  pour Bottom: 32.44,57.84 57.45,57.9 57.45,43.11 32.44,43.04
  pour Bottom: 24.82,57.27 13.96,57.27 13.96,49.65 24.82,49.65
  pour Bottom: 49.26,10.98 55.68,10.98 55.68,8.05 49.26,8.05
  pour Bottom: 3.97,22.28 25.39,22.28 25.39,13.77 3.97,13.77
  pour Bottom: 50.41,50.03 56.82,50.03 56.82,47.11 50.41,47.11
  pour Bottom: 1.64,49.84 8.05,49.84 8.05,46.92 1.64,46.92
  pour Bottom: 2.4,10.79 8.81,10.79 8.81,7.86 2.4,7.86
MIC1N  (via drill 0.5)
  Top 0.61: v23.74,31.99 23.74,31.87 C105.1
  Top 0.813: R109.2 26.38,30.47 C105.1
  Bottom 0.254: X1.5 28.44,20.37 27.74,21.07 27.74,29.33 25.07,31.99 v23.74,31.99
MIC1P  (via drill 0.5)
  Top 0.61: v23.74,33.39 24.69,34.34 24.82,34.34 C106.1
  Top 0.813: R110.1 25.14,37.62 C106.1
  Bottom 0.254: X1.4 29.45,9.96 28.88,10.53 28.88,20.56 28.18,21.26 28.18,29.58 24.37,33.39 v23.74,33.39
MIC2N
  Top 0.406: X1.7 25.33,7.1 24.12,8.31 24.12,19.17 23.93,19.36 23.93,22.47 23.67,22.72 23.67,25.39 23.99,25.71 24.31,25.71 24.31,25.73 R209.2
  Top 0.61: R209.2 24.98,28.28 C205.1
MIC2P
  Top 0.406: X1.8 25.39,12.63 24.82,13.2 24.82,20.43 C206.1
  Top 0.61: R210.1 25.33,24.03 C206.1
MIC3N  (via drill 0.5)
  Top 0.61: R309.2 31.9,31.38 C305.1 32.66,30.63 | 32.63,30.6 32.66,30.63 | v34.02,31.99 32.66,30.63
  Bottom 0.254: X1.3 30.47,13.58 31.61,14.72 31.61,29.58 v34.02,31.99
MIC3P  (via drill 0.5)
  Top 0.406: X1.6 27.42,11.54 v30.85,14.98 | v34.15,33.26 33,34.41 C306.1
  Top 0.61: R310.1 32.88,34.79 C306.1
  Bottom 0.254: v30.85,14.98 31.1,15.23 31.1,29.71 33.32,31.93 33.32,32.44 v34.15,33.26
MIC4N
  Top 0.406: X1.1 32.69,7.29 32.69,10.34 34.34,11.99 34.34,17.77 33.83,18.28 33.83,22.98 34.21,23.36 34.21,25.33 33.83,25.71 33.54,25.71 R409.2
  Top 0.61: R409.2 32.84,28.28 C405.1
MIC4P
  Top 0.254: X1.2
  Top 0.406: X1.2 31.48,10.02 33.58,12.12 33.58,17.58 33.07,18.09 33.07,20.37 33.01,20.37 C406.1 | R410.1 32.75,24.28
  Top 0.61: R410.1 32.84,21.48 C406.1
N$1
  Top 0.305: R106.1 12.39,34.09 | 10.83,35.65 R105.2
  Top 0.406: U1.6 14.88,33.17 13.96,34.09 12.39,34.09 | R106.1 C103.2 10.59,34.37 10.59,35.42 10.82,35.65 10.83,35.65
N$2
  Top 0.305: 45.43,33.96 R306.1 45.86,34.11 45.86,34.18
  Top 0.406: U2.2 42.88,33.04 43.8,33.96 45.43,33.96 | R306.1 C303.2 47.61,35.46 R305.2
N$3
  Top 0.406: LED1.C 30.26,38.59 LED3.K 30.26,42.86 R1.2
  Bottom 0.61: LED1.C 30.26,38.32 LED3.K
N$4
  Top 0.406: U1.12 16.83,25.25 18.02,24.06 18.02,23.7 R211.2
N$5  (via drill 0.5)
  Top 0.305: U1.3 16.83,33.98 v17.2,34.34
  Top 0.406: v17.51,38.09 17.13,38.47 17.13,38.83 R111.2
  Bottom 0.305: v17.2,34.34 17.2,36.95 17.51,37.27 v17.51,38.09
N$6
  Top 0.406: MIC1.+ 50.08,4.89 43.21,11.76 R400.1 43.21,17.29 42.21,18.28 42.21,20.12 C401.2
N$7  (via drill 0.5)
  Top 0.254: 13.35,41.77 R100.1 | 14.4,41.77 14.78,41.39 C101.2 14.21,41.84
  Top 0.305: C101.2 14.78,41.07 14.4,41.07 14.4,41.54
  Top 0.406: 14.4,41.77 13.35,41.77 | 14.21,41.84 v14.21,48.31 | MIC3.+ 7.63,54.89 v8.88,53.65
  Bottom 0.406: v14.21,48.31 v8.88,53.65
N$8
  Top 0.305: C401.1 41.89,23.74
  Top 0.406: U2.12 42.23,24.58 C401.1 | R402.2 41.94,23.7 41.89,23.74
N$9
  Top 0.305: 14.15,35.83 R102.2 14.11,37.79 C101.1
  Top 0.406: U1.5 15.53,33.47 14.15,34.85 14.15,35.83
N$10
  Top 0.406: R101.2 R100.2 C100.1
N$11
  Top 0.254: R401.2 44.37,13.2 | 44.37,14.91 44.75,14.91 C400.1
  Top 0.406: 44.37,13.2 44.37,14.91 | R400.2 44.91,15.38 C400.1
N$12
  Top 0.406: C104.2 R108.1 17.48,33 U1.2 17.48,31.52 17.83,31.17 18.95,31.17 R107.2
N$13
  Top 0.305: 37.56,27.08 R407.2
  Top 0.406: 37.56,27.08 38.09,27.61 39.99,27.61 40.28,27.32 U2.9 40.28,25.93 39.29,24.95 39.29,24.6 R408.1 38.28,23.59 38.28,21.77 37.49,20.98 C404.2
N$14
  Top 0.406: U1.9 14.88,25.68 14.27,25.07 12.33,25.07 R206.1 | R206.1 R205.2 | C203.2 R206.1
N$15
  Top 0.305: R411.2 39.36,22.79 39.99,23.42 39.99,24.75 40.93,25.69 U2.10
N$16  (via drill 0.5)
  Top 0.406: U2.5 40.93,33.47 v40.63,33.77 | R311.2 40.35,38.3 40.06,38.6 v40.06,39.55
  Bottom 0.406: v40.63,33.77 39.74,34.66 39.74,37.01 40.06,37.33 v40.06,39.55
N$18  (via drill 0.5)
  Top 0.406: MIC2.+ 52.79,54.89 v49.96,52.06 | R300.1 48.22,42.75 47.23,43.74 46.6,43.74 v46.53,43.8 46.53,41.71 C301.2
  Bottom 0.254: 49.96,52 v49.96,52.06
  Bottom 0.406: v46.53,43.8 47.8,45.08 47.8,49.84 49.96,52
N$19
  Top 0.406: U2.3 42.23,33.53 43.68,34.98 43.68,35.68 | R302.2 43.65,35.65 43.68,35.68 | 43.68,35.68 43.68,36.05 C301.1
N$20
  Top 0.406: C300.1 50.85,44.57 R301.2 R300.2
N$21
  Top 0.406: R307.2 37.56,31.95 38.09,31.42 39.93,31.42 40.28,31.77 U2.6 40.28,32.98 39.55,33.71 39.55,33.92 R308.1 38.05,35.42 C304.2
N$22
  Top 0.406: MIC4.+ 7.68,4.89 14.62,11.83 R200.1 14.62,17.03 15.35,17.77 15.35,19.42 C201.2
N$23
  Top 0.406: U1.10 15.53,25.06 14.27,23.8 R202.2
  Top 0.61: C201.1 14.68,23.17 R202.2
N$24
  Top 0.254: C200.1 13.41,14.57
  Top 0.406: 13.41,14.57 R201.2
  Top 0.61: R200.2 12.92,15.07 C200.1
N$25
  Top 0.406: R207.2 20.21,27.08 19.67,27.61 17.77,27.61 17.48,27.32 U1.13 17.48,25.68 18.09,25.07 R208.1 19.42,24.67 19.42,22.53 20.27,21.68 C204.2
OUTN1
  Top 0.254: 22.12,30.25 C105.2
  Top 0.305: 14.21,32.41 U1.7
  Top 0.406: 14.21,32.41 R106.2 C103.1 | 22.12,30.25 R107.1 19.52,30.47 12.56,30.47 D100.A
  Top 0.61: 21.96,30.91 22.34,30.54 C105.2 | D100.A 12.43,32.36 R106.2
  Top 0.813: 21.96,30.91 21.96,32.25 D101.C
OUTN2
  Top 0.254: 21.99,28.78 C205.2
  Top 0.406: 21.99,28.78 R207.1 19.97,28.56 12.62,28.56 D200.A | C203.1 R206.2 14.21,26.62 U1.8
  Top 0.61: D201.C 22.34,26.72 C205.2 | D200.A 12.43,28.44 12.18,28.18 R206.2
OUTN3
  Top 0.305: 45.62,32.39 45.64,32.39 45.64,32.38 45.6,32.41 R306.2 45.56,32.39
  Top 0.406: 43.53,31.15 U2.1 45.56,32.39 | 43.53,31.15 42.85,30.47 38.11,30.47 R307.1 35.83,30.25 C305.2 | R306.2 C303.1 | 43.53,31.15 44.59,31.15 D300.A
  Top 0.61: D301.C 36.05,31.22 35.99,31.22 C305.2
OUTN4
  Top 0.406: 43.53,27.88 U2.14 45.47,26.64 R406.2 C403.1 | 43.53,27.88 42.85,28.56 37.79,28.56 R407.1 35.7,28.78 C405.2 D401.C | 43.53,27.88 44.59,27.88 D400.A
OUTP1
  Top 0.406: C104.1 R108.2 19.13,32.95 18.34,32.95 18.13,32.74 U1.1
  Top 0.61: C106.2 22.59,34.92 D103.C 20.05,37.71 D102.A 20.14,37.5 C104.1
OUTP2
  Top 0.406: U1.14 18.8,26.64 19.35,26.09 19.7,26.09 20.35,25.43 | 20.35,25.43 R208.2 | 20.35,25.43 20.37,25.41 C204.1 21.32,22.43 21.32,21.64 21.51,21.45 22.02,21.45
  Top 0.61: 22.02,21.45 C206.2 22.47,20.89 22.47,19.1 D202.A D203.C
OUTP3
  Top 0.406: C306.2 35.8,34.66 36.25,34.22 R308.2 37.56,34.11 38.6,33.07 38.95,33.07 U2.7 | D302.A 36.16,36.76 C304.1
  Top 0.61: D303.C D302.A 34.53,36.38
  Top 0.813: 34.53,36.38 34.53,36.19 C306.2
OUTP4
  Top 0.406: U2.8 R408.2 37.33,24.33 C404.1 36.35,21.71 36.06,21.71 35.36,21.01 C406.2
  Top 0.61: 35.36,21.01 35.36,19.04 D402.A D404.C
R405
  Top 0.406: R406.1 R405.2 | U2.13 42.88,25.93 43.74,25.07 45.56,25.07 R406.1 | R406.1 C403.2
VGND1
  Top 0.254: 10.93,37.57 R105.1 | 8.24,38.34 8.6,38.7 R104.2
  Top 0.305: C107.2 10.93,38.48
  Top 0.406: R103.1 R104.2 C107.2 10.74,38.73 12.37,38.73 13.51,39.87 15.84,39.87 R111.1 | 10.93,38.48 10.93,37.57 | C102.1 7.86,38.34 8.24,38.34 | R105.1 10.92,37.35 R102.1
VGND2
  Top 0.406: R202.1 R205.1 | R202.1 C207.2 R204.2 10.61,20.52 C202.1 R203.1 | R211.1 18.15,21.87 R202.1
VGND3
  Top 0.406: R311.1 42.81,37.52 45.52,37.52 45.68,37.35 R302.1 R305.1 47.61,37.54 C307.2 R304.2 49.94,38.85 50.59,38.85 C302.1 51.64,37.35 R303.1
VGND4
  Top 0.305: C402.1 47.21,20.59 | 43.21,22.28 40.5,22.28 40.06,21.83 40.06,21.68 R411.1
  Top 0.406: R403.1 C402.1 47.61,19.99 | R404.2 C407.2 R402.1 | 43.21,22.28 43.27,22.28 R402.1 | R402.1 R405.1
  Top 0.61: R404.2 47.15,20.65 C402.1

### Text on the board
tNames: MIC3 | MIC2 | MIC4 | MIC1
tRestrict: MIC3 | MIC2 | MIC4 | MIC1
bRestrict: MIC2 | MIC3 | nt.upb.de 2012 | MicBoard | Ver 1.2 | MIC1 | MIC4